# Altium schematic sheet RS232_Interface.SchDoc
size A3; DocumentNumber: 3; SheetNumber: 3; SheetTotal: 11
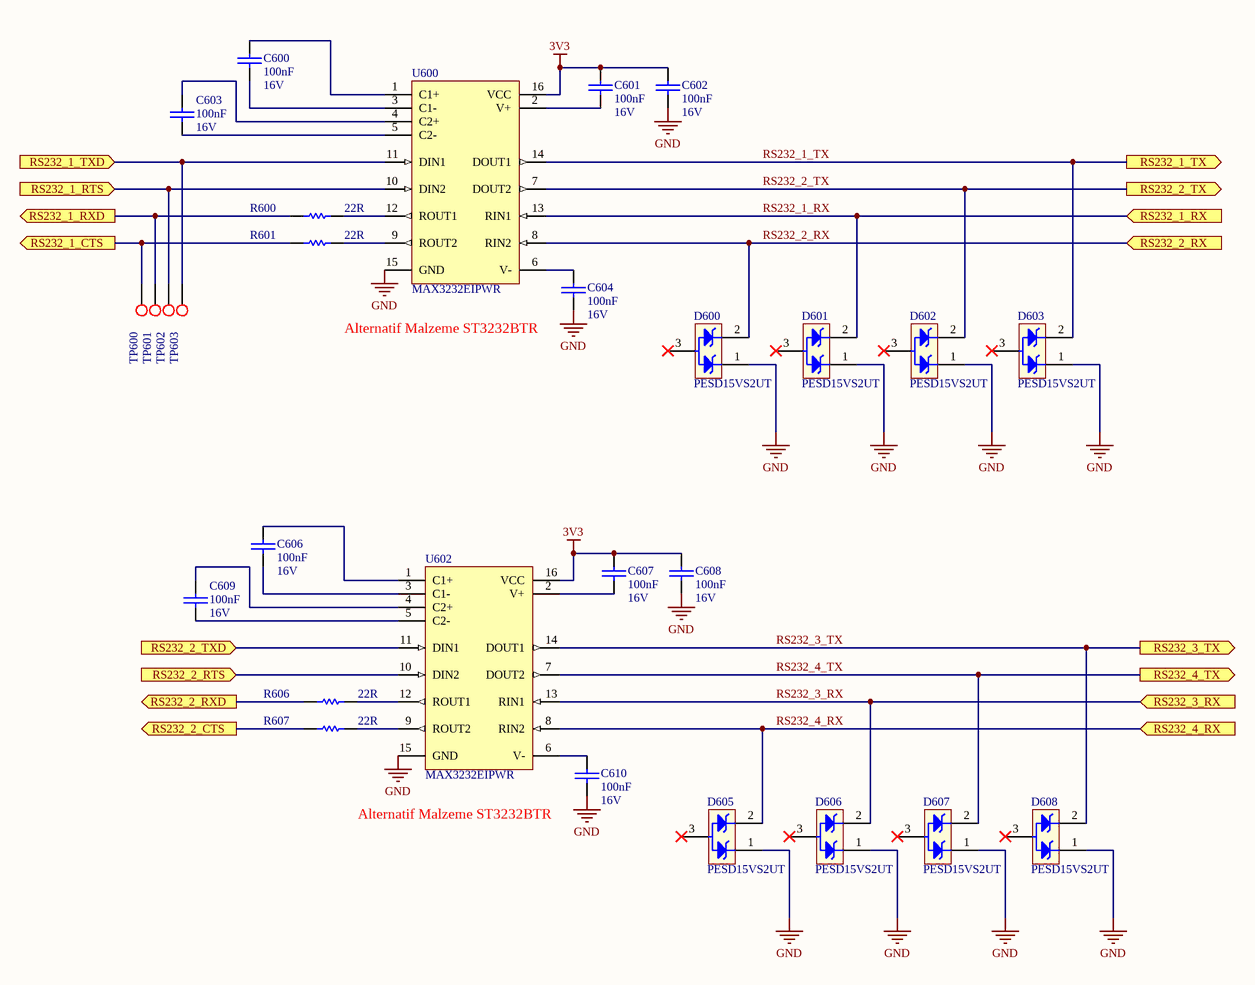
[diagram p0: RS232_Interface.SchDoc]

## Parts
C600  Operating Voltage: 16V  [CAPC1005X06N]  (hidden comment: 100nF)
C601  Operating Voltage: 16V  [CAPC1005X06N]  (hidden comment: 100nF)
C602  Operating Voltage: 16V  [CAPC1005X06N]  (hidden comment: 100nF)
C603  Operating Voltage: 16V  [CAPC1005X06N]  (hidden comment: 100nF)
C604  Operating Voltage: 16V  [CAPC1005X06N]  (hidden comment: 100nF)
C606  Operating Voltage: 16V  [CAPC1005X06N]  (hidden comment: 100nF)
C607  Operating Voltage: 16V  [CAPC1005X06N]  (hidden comment: 100nF)
C608  Operating Voltage: 16V  [CAPC1005X06N]  (hidden comment: 100nF)
C609  Operating Voltage: 16V  [CAPC1005X06N]  (hidden comment: 100nF)
C610  Operating Voltage: 16V  [CAPC1005X06N]  (hidden comment: 100nF)
D600  PESD15VS2UT  [SOT95P230X111-3N]
D601  PESD15VS2UT  [SOT95P230X111-3N]
D602  PESD15VS2UT  [SOT95P230X111-3N]
D603  PESD15VS2UT  [SOT95P230X111-3N]
D605  PESD15VS2UT  [SOT95P230X111-3N]
D606  PESD15VS2UT  [SOT95P230X111-3N]
D607  PESD15VS2UT  [SOT95P230X111-3N]
D608  PESD15VS2UT  [SOT95P230X111-3N]
R600  22R  [RESC1005X04N]
R601  22R  [RESC1005X04N]
R606  22R  [RESC1005X04N]
R607  22R  [RESC1005X04N]
TP600  AEMT-C00S-1000-0000  [TP100]  (value not drawn)
TP601  AEMT-C00S-1000-0000  [TP100]  (value not drawn)
TP602  AEMT-C00S-1000-0000  [TP100]  (value not drawn)
TP603  AEMT-C00S-1000-0000  [TP100]  (value not drawn)
U600  MAX3232EIPWR  [TSOP65P640X120-16N]
U602  MAX3232EIPWR  [TSOP65P640X120-16N]

## Ports
RS232_1_CTS (out), RS232_1_RTS (in), RS232_1_RX (in), RS232_1_RXD (out), RS232_1_TX (out), RS232_1_TXD (in), RS232_2_CTS (out), RS232_2_RTS (in), RS232_2_RX (in), RS232_2_RXD (out), RS232_2_TX (out), RS232_2_TXD (in), RS232_3_RX (in), RS232_3_TX (out), RS232_4_RX (in), RS232_4_TX (out)

## Nets
3V3: C601.2 C602.2 C607.2 C608.2 U600.16(VCC) U602.16(VCC)
GND: C602.1 C604.1 C608.1 C610.1 D600.1 D601.1 D602.1 D603.1 D605.1 D606.1 D607.1 D608.1 U600.15(GND) U602.15(GND)
RS232_1_CTS: R601.1 TP600.1 ; port RS232_1_CTS
RS232_1_RTS: TP602.1 U600.10(DIN2) ; port RS232_1_RTS
RS232_1_RX: D601.2 U600.13(RIN1) ; port RS232_1_RX
RS232_1_RXD: R600.1 TP601.1 ; port RS232_1_RXD
RS232_1_TX: D603.2 U600.14(DOUT1) ; port RS232_1_TX
RS232_1_TXD: TP603.1 U600.11(DIN1) ; port RS232_1_TXD
RS232_2_CTS: R607.1 ; port RS232_2_CTS
RS232_2_RTS: U602.10(DIN2) ; port RS232_2_RTS
RS232_2_RX: D600.2 U600.8(RIN2) ; port RS232_2_RX
RS232_2_RXD: R606.1 ; port RS232_2_RXD
RS232_2_TX: D602.2 U600.7(DOUT2) ; port RS232_2_TX
RS232_2_TXD: U602.11(DIN1) ; port RS232_2_TXD
RS232_3_RX: D606.2 U602.13(RIN1) ; port RS232_3_RX
RS232_3_TX: D608.2 U602.14(DOUT1) ; port RS232_3_TX
RS232_4_RX: D605.2 U602.8(RIN2) ; port RS232_4_RX
RS232_4_TX: D607.2 U602.7(DOUT2) ; port RS232_4_TX
NetC600_1: C600.1 U600.3(C1-)
NetC600_2: C600.2 U600.1(C1+)
NetC601_1: C601.1 U600.2(V+)
NetC603_1: C603.1 U600.5(C2-)
NetC603_2: C603.2 U600.4(C2+)
NetC604_2: C604.2 U600.6(V-)
NetC606_1: C606.1 U602.3(C1-)
NetC606_2: C606.2 U602.1(C1+)
NetC607_1: C607.1 U602.2(V+)
NetC609_1: C609.1 U602.5(C2-)
NetC609_2: C609.2 U602.4(C2+)
NetC610_2: C610.2 U602.6(V-)
NetR600_2: R600.2 U600.12(ROUT1)
NetR601_2: R601.2 U600.9(ROUT2)
NetR606_2: R606.2 U602.12(ROUT1)
NetR607_2: R607.2 U602.9(ROUT2)

Not connected (* = marked no-connect by the designer): D600 3*; D601 3*; D602 3*; D603 3*; D605 3*; D606 3*; D607 3*; D608 3*

## Notes on the sheet
- Alternatif Malzeme ST3232BTR
- Title
- Size:
- Date:
- A3
- Number:
- Time:
- Revision:
- Sheet
- of
- File:

## Library data of the parts
C600-C604 C606-C610 = ACC7-2100-S241-0000: CAP, CER, X7R, 100nF, %10, 16V, 0402; Manufacturer: Murata; Manufacturer Part Number: GRM155R71C104KA88D; CR: 000049; Requested by: MU; Lead Finish: Pb Free; Material: Ceramic, X7R; Definition Date: 14.08.2012; Revision Date: *; Price: *; Supplier: *; Supplier Part Number: *; DS: 000049; Operating Temp: -55 to 125 C; Storage Temp: -55 to 125 C; Status: Active; Package Reference: EIA 0402, Metric 1005; Component Type: Capacitor; Footprint Type: SMD; Published by: MU; ESR: *; FR: *; Value: 100nF
D600-D603 D605-D608 = AS1H-950M-SI20-0000: Diode, TVS, ESD Protection, 15V, PESD15VS2UT, SOT-23; Manufacturer: NXP; CR: 451; DS: 000452; Lead Finish: Pb Free; Published by: MU; Requested by: NK; Price: *; Manufacturer Part Number: PESD15VS2UT; Definition Date: 11.12.2014; Footprint Type: SMD; JEDEC Code: *; Operating Temp: -65°C to 150°C; Package Reference: SOT-23; Revision Date: *; Status: Active; Storage Temp: -65°C to 150°C; Supplier: *; Supplier Part Number: *; Component Type: DIODE; Forward Voltage: *; Reverse Voltage: 15V; Value: PESD15VS2UT
R600 R601 R606 R607 = AR19-1220-S2B2-0000: RES, E24, Thick Film, SMD, 22R, 1%, 0.1W, 0402; Manufacturer: Panasonic; Manufacturer Part Number: ERJ-2RKF22R0X; CR: DS00073; Requested by: MU; Lead Finish: Pb Free; Max. Operating Voltage: 50V; Definition Date: 16.08.2012; Revision Date: *; Price: *; Supplier: *; Supplier Part Number: *; DS: DS00073; Operating Temp: -55 to 155 C; Storage Temp: -55 to 155 C; Status: Active; Package Reference: EIA 0402, Metric 1005; Component Type: Resistor; Footprint Type: SMD; Published by: MU; JEDEC Code: *; Material: Thick Film; ESR: *; FR: *; Power Rating: 0.1W; Value: 22R
TP600-TP603 = AEMT-C00S-1000-0000: Test Point, Circular, 1mm; Text: TEST_POINT
U600 U602 = AT41-0000-SM90-0540: IC, Interface, RS232 Driver, MAX3232EIPWR, TSSOP-16; Manufacturer: Texas Instruments; Manufacturer Part Number: MAX3232EIPWRQ1; CR: 000008; Requested by: MAY; Lead Finish: Pb Free; Published by: OO; JEDEC Code: MO-187 AA; Definition Date: 18.04.2012; Price: 1.8; Supplier: *; Supplier Part Number: *; DS: 000008; Operating Temp: -40 to 85 C; Revision Date: 12.11.2012; Status: Active; Storage Temp: -65 to 150 C; Component Type: IC; Package Reference: TSSOP-16; Footprint Type: SMD; FR: *; Value: MAX3232EIPWR